# Altium schematic sheet Schematico_PCL.SchDoc
size A4
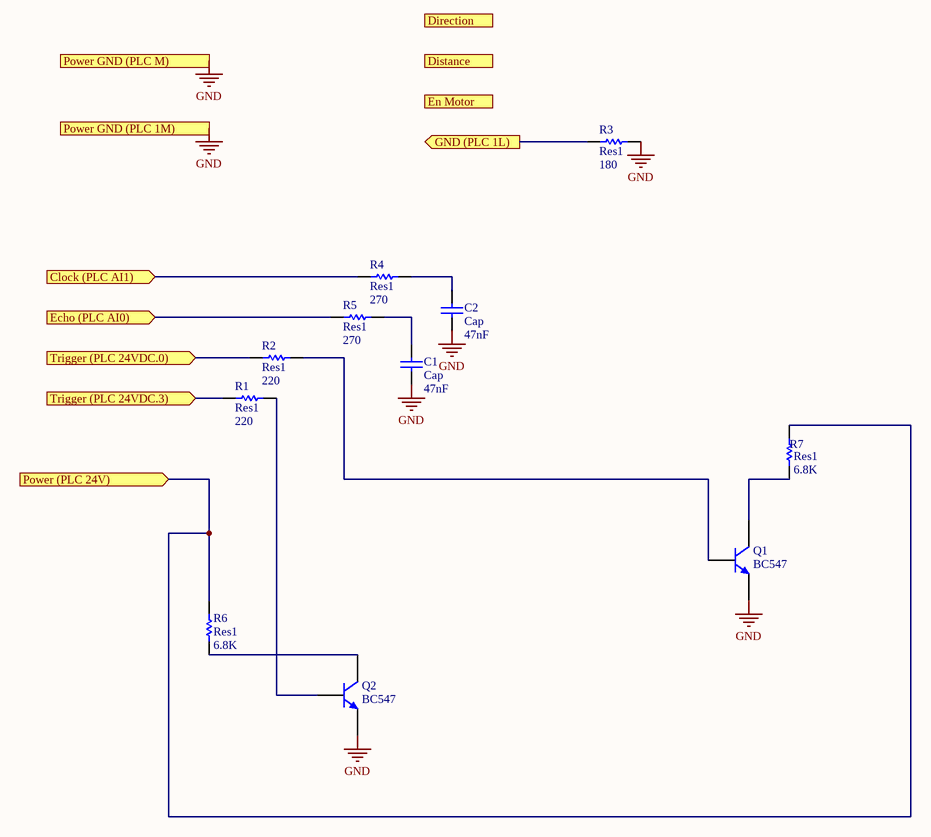
[diagram p0: Schematico_PCL.SchDoc]

## Parts
C1  Cap  value 47nF  [RAD-0.3]
C2  Cap  value 47nF  [RAD-0.3]
Q1  BC547  [TO-226-AA]
Q2  BC547  [TO-226-AA]
R1  Res1  value 220  [AXIAL-0.3]
R2  Res1  value 220  [AXIAL-0.3]
R3  Res1  value 180  [AXIAL-0.3]
R4  Res1  value 270  [AXIAL-0.3]
R5  Res1  value 270  [AXIAL-0.3]
R6  Res1  value 6.8K  [AXIAL-0.3]
R7  Res1  value 6.8K  [AXIAL-0.3]

## Ports
Clock (PLC AI1) (in), Direction (out), Distance (out), Echo (PLC AI0) (in), En Motor (out), GND (PLC 1L) (out), Power (PLC 24V) (in), Power GND (PLC 1M) (in), Power GND (PLC M) (in), Trigger (PLC 24VDC.0) (in), Trigger (PLC 24VDC.3) (in)

## Nets
GND: C1.1 C2.1 Q1.3(E) Q2.3(E) R3.2 ; port Power GND (PLC M), port Power GND (PLC 1M)
Clock (PLC AI1): R4.1 ; port Clock (PLC AI1)
Echo (PLC AI0): R5.1 ; port Echo (PLC AI0)
GND (PLC 1L): R3.1 ; port GND (PLC 1L)
Power (PLC 24V): R6.2 R7.2 ; port Power (PLC 24V)
Trigger (PLC 24VDC.0): R2.1 ; port Trigger (PLC 24VDC.0)
Trigger (PLC 24VDC.3): R1.1 ; port Trigger (PLC 24VDC.3)
NetC1_2: C1.2 R5.2
NetC2_2: C2.2 R4.2
NetQ1_1: Q1.1(C) R7.1
NetQ1_2: Q1.2(B) R2.2
NetQ2_1: Q2.1(C) R6.1
NetQ2_2: Q2.2(B) R1.2

## Library data of the parts
C1 C2 = Cap: Capacitor; Published: 8-Jun-2000; LatestRevisionDate: 17-Jul-2002; LatestRevisionNote: Re-released for DXP Platform.; PackageReference: RAD-0.3; Publisher: Altium Limited; PackageDescription: Radial Cap, Thru-Hole; 2 Leads; 0.3 in Pin Spacing
Q1 Q2 = NPN: NPN Bipolar Transistor; Published: 8-Jun-2000; LatestRevisionDate: 17-Jul-2002; LatestRevisionNote: Re-released for DXP Platform.; PackageReference: TO-226-AA; Publisher: Altium Limited; PackageDescription: TO, Flat Index; 3 In-Line, Axial Leads; Body Dia. 4.8mm; Leads 0.55 x 0.51 mm (max); Code_JEDEC: TO-226-AA
R1-R7 = Res1: Resistor; Published: 8-Jun-2000; LatestRevisionDate: 17-Jul-2002; LatestRevisionNote: Re-released for DXP Platform.; PackageReference: AXIAL-0.3; Publisher: Altium Limited; PackageDescription: Axial Device, Thru-Hole; 2 Leads; 0.3 in Pin Spacing